# EAGLE design hwlcd (EAGLE 9.3.1)
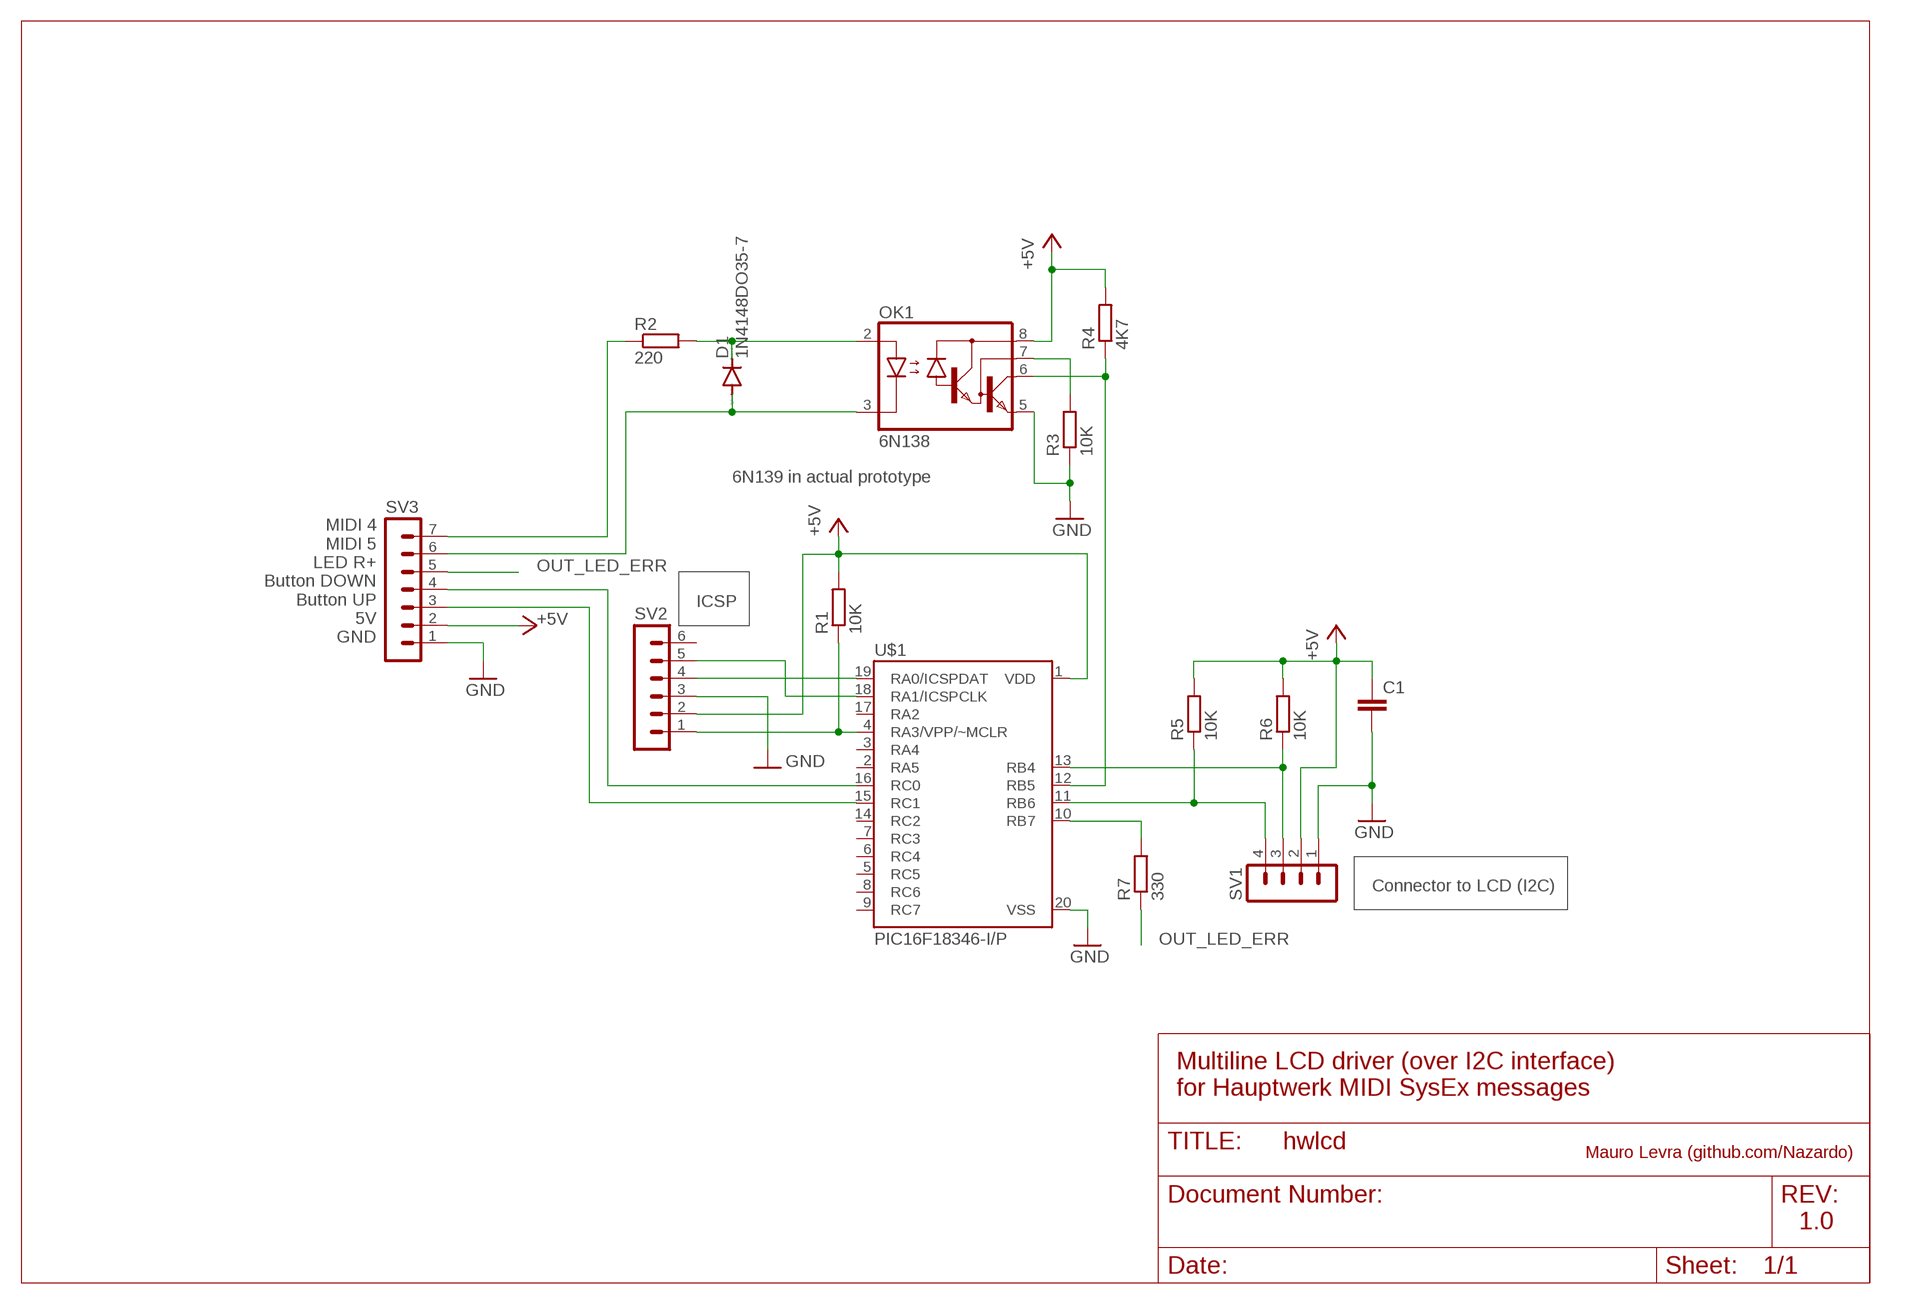
[diagram p0: schematic, sheet 1]

## Parts
C1  C-EU050-025X075  [C050-025X075]
D1  1N4148DO35-7  [DO35-7]
OK1  6N138  [DIL08]
R1  10K  R-EU_0204/7  [0204/7]
R2  220  R-EU_0204/7  [0204/7]
R3  10K  R-EU_0204/5  [0204/5]
R4  4K7  R-EU_0204/7  [0204/7]
R5  10K  R-EU_0207/2V  [0207/2V]
R6  10K  R-EU_0207/2V  [0207/2V]
R7  330  R-EU_0204/2V  [0204V]
SV1  MA04-1  [MA04-1]
SV2  MA06-1  [MA06-1]
SV3  MA07-1  [MA07-1]
U$1  PIC16F18346-I/P  [DIL20]

## Nets
+5V: C1.1 OK1.8(VCC) R1.2 R4.2 R5.2 R6.2 SV1.2 SV2.2 SV3.2 U$1.1(VDD)
GND: C1.2 OK1.5(GND) R3.1 SV1.1 SV2.3 SV3.1 U$1.20(VSS)
N$1: SV3.3 U$1.15(RC1)
N$2: SV3.4 U$1.16(RC0)
N$3: SV2.5 U$1.18(RA1/ICSPCLK)
N$4: R1.1 SV2.1 U$1.4(RA3/VPP/~MCLR)
N$5: SV2.4 U$1.19(RA0/ICSPDAT)
N$6: D1.C OK1.2(A) R2.2
N$7: D1.A OK1.3(C) SV3.6
N$8: R2.1 SV3.7
N$9: R7.2 U$1.10(RB7)
N$10: R6.1 SV1.3 U$1.13(RB4)
N$11: OK1.6(VO) R4.1 U$1.12(RB5)
N$12: R5.1 SV1.4 U$1.11(RB6)
N$13: OK1.7(VB) R3.2
OUT_LED_ERR: R7.1 SV3.5
Unconnected: SV2.6 U$1.2(RA5) U$1.3(RA4) U$1.5(RC5) U$1.6(RC4) U$1.7(RC3) U$1.8(RC6) U$1.9(RC7) U$1.14(RC2) U$1.17(RA2)

## Notes on the sheet
- 6N139 in actual prototype
- ICSP
- MIDI 4
  MIDI 5
  LED R+
  Button DOWN
  Button UP
  5V
  GND
- Connector to LCD (I2C)
- Multiline LCD driver (over I2C interface)
  for Hauptwerk MIDI SysEx messages
- Mauro Levra (github.com/Nazardo)
- 1.0

## Library data of the parts
C1 = rcl:C-EU: CAPACITOR, European symbol; SPICEPREFIX: C
D1 = diode:1N4148: DIODE high speed (Philips)
OK1 = optocoupler:6N138: MOTOROLA OPTO COUPLER; MF: VISHAY/TELEFUNKEN; MPN: 6N138; OC_FARNELL: 9860150; OC_NEWARK: 35K5294
R1-R7 = rcl:R-EU_: RESISTOR, European symbol; SPICEPREFIX: R
SV1 = con-lstb:MA04-1: PIN HEADER; OC_FARNELL: unknown; OC_NEWARK: unknown
SV2 = con-lstb:MA06-1: PIN HEADER; OC_FARNELL: unknown; OC_NEWARK: unknown
SV3 = con-lstb:MA07-1: PIN HEADER; OC_FARNELL: unknown; OC_NEWARK: unknown
U$1 = mylibrary:PIC16F18346-I/P: PIC16(L)F18346 microcontrollers feature Analog, Core Independent Peripherals and CommunicationPeripherals, combined with eXtreme Low Power (XLP) for a wide range of general purpose and low-power applications. The Peripheral Pin Select (PPS) functionality enables pin mapping when using the digital peripherals (CLC, CWG, CCP,PWM and communications) to add flexibility to the application design.

## Net classes
0 default: width 0.762 mm

## Board
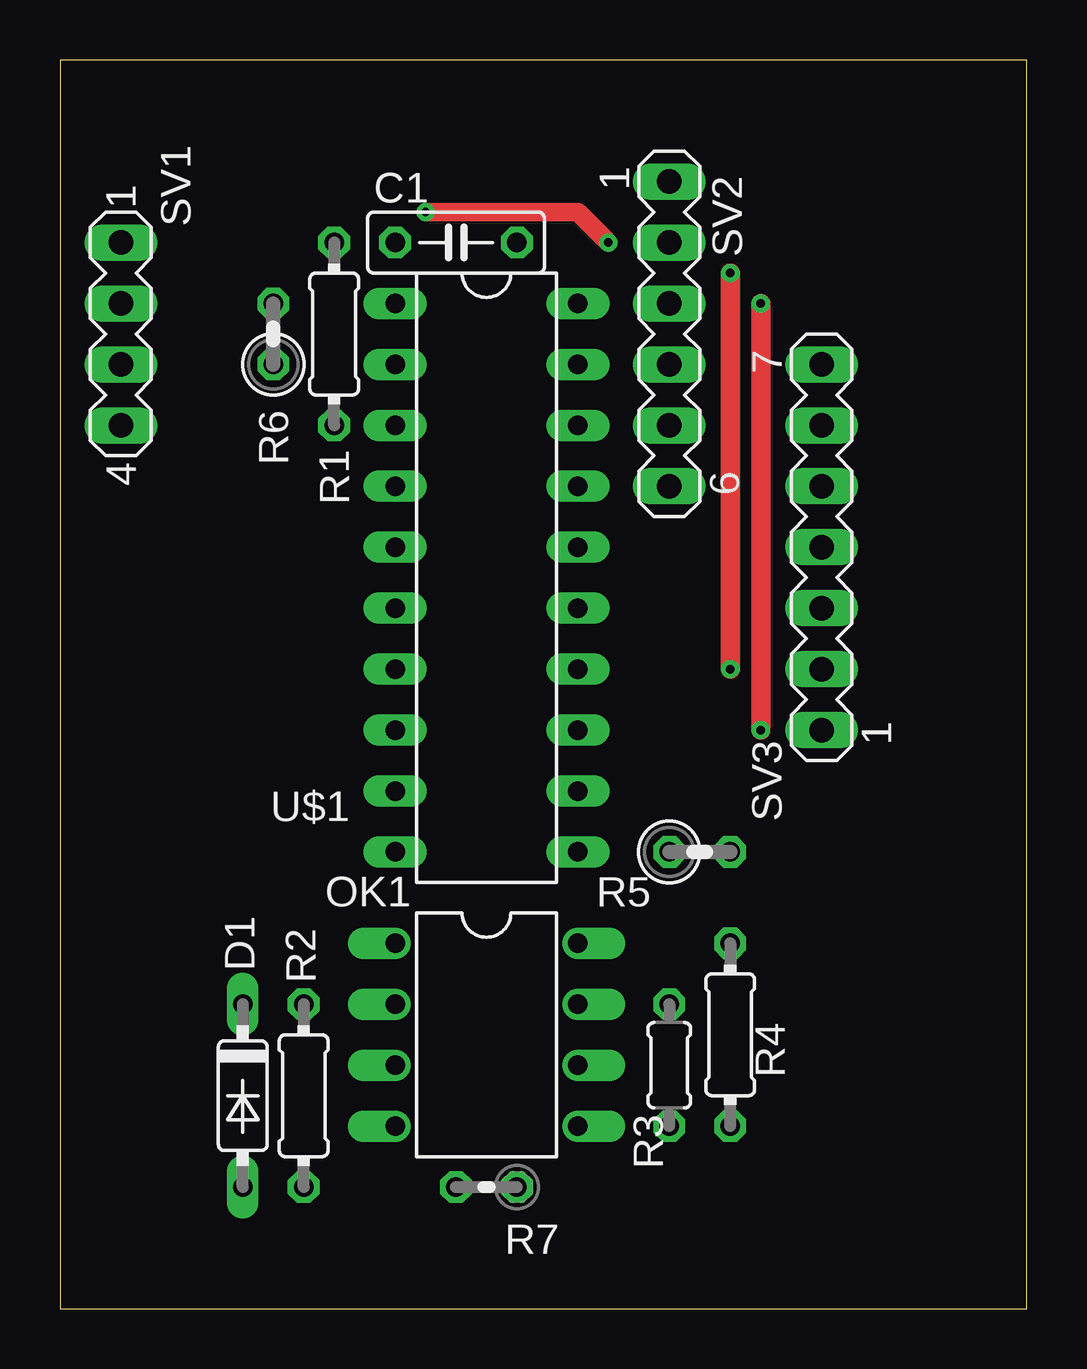
[diagram p1: board, top side]
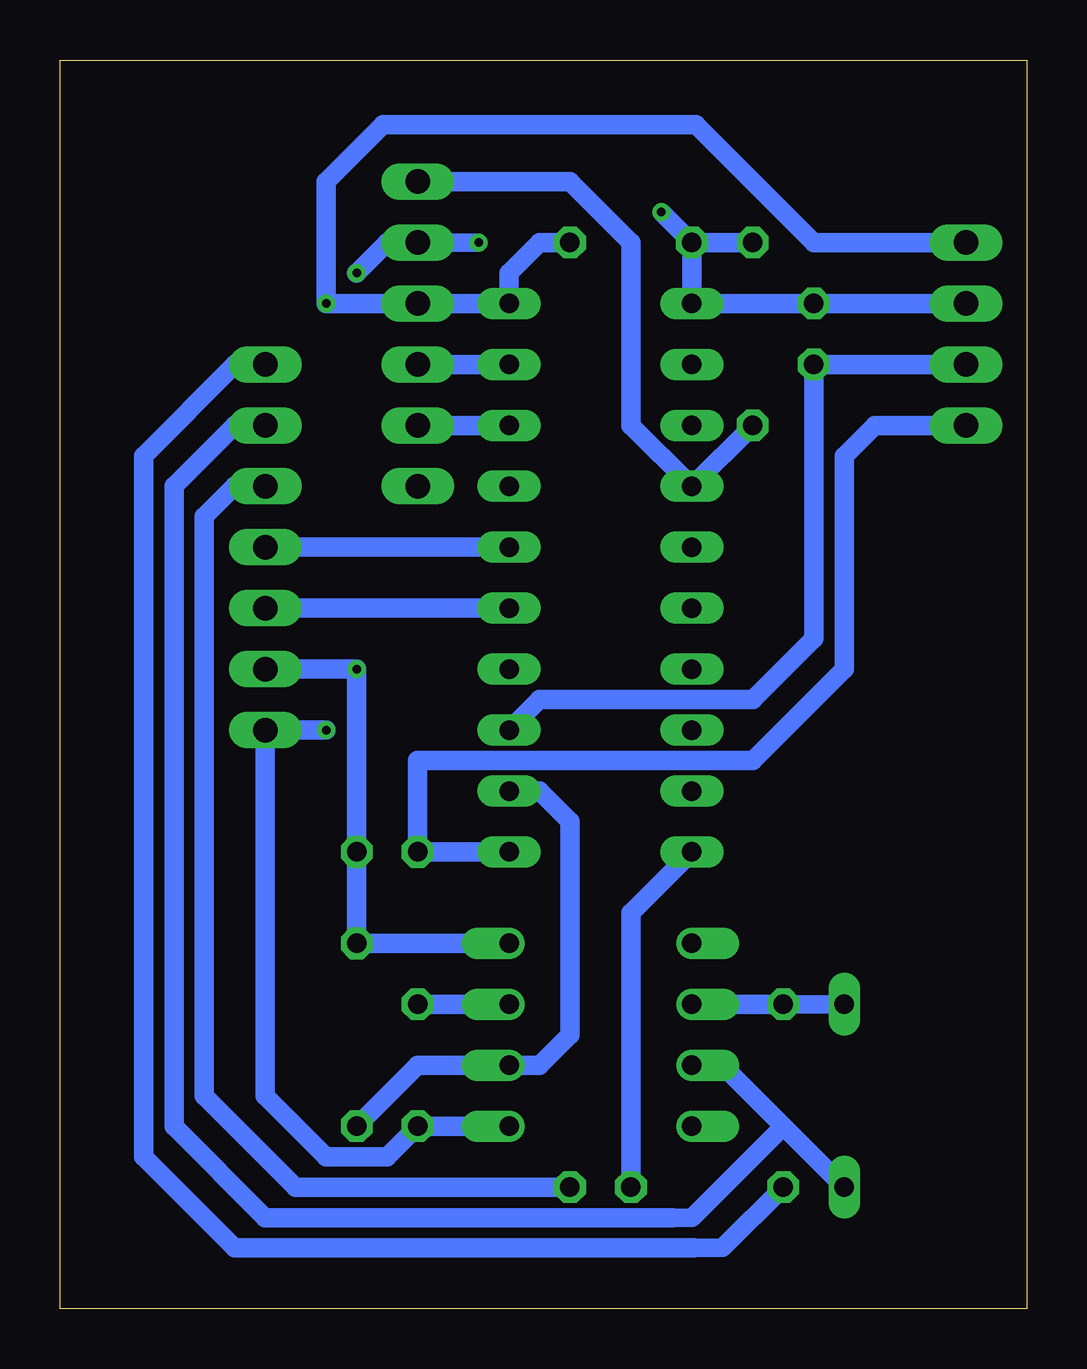
[diagram p2: board, bottom side, seen from below]

Size 40.31 x 52.06 mm. Coordinates in mm from the lower left corner, seen from the top.
Outline: 0,0 40.31,0 40.31,52.06 0,52.06 0,0
Copper layers (1*16): Top 0.035mm / dielectric 1.5mm / Bottom 0.035mm
Design rules "default": minimum track width 6mil, minimum drill 0.35mm, track to track 6mil, track to pad 6mil, pad to pad 6mil, via to via 6mil, smd to smd 6mil, copper to edge 40mil, drill to drill 6mil, minimum pad ring 10mil, minimum via ring 8mil, stop-mask expansion 4mil, vias tented up to drill 0mil, thermal gap 10mil

### Footprints (pad centres in the part's own frame; a part is rotated, then mirrored left to right if it is on the bottom)
C050-025X075 = drill 0.813 octagon: 1 -2.54,0; 2 2.54,0
DO35-7 = drill 0.813 long: A 3.81,0; C -3.81,0
DIL08 = drill 0.813 offset: 1 -3.81,-3.81; 2 -1.27,-3.81; 3 1.27,-3.81; 4 3.81,-3.81; 5 3.81,3.81; 6 1.27,3.81; 7 -1.27,3.81; 8 -3.81,3.81
0204/7 = drill 0.813 octagon: 1 -3.81,0; 2 3.81,0
0204/5 = drill 0.813 octagon: 1 -2.54,0; 2 2.54,0
0207/2V = drill 0.813 octagon: 1 -1.27,0; 2 1.27,0
0204V = drill 0.813 octagon: 1 -1.27,0; 2 1.27,0
MA04-1 = drill 1.016 long: 1 -3.81,0; 2 -1.27,0; 3 1.27,0; 4 3.81,0
MA06-1 = drill 1.016 long: 1 -6.35,0; 2 -3.81,0; 3 -1.27,0; 4 1.27,0; 5 3.81,0; 6 6.35,0
MA07-1 = drill 1.016 long: 1 -7.62,0; 2 -5.08,0; 3 -2.54,0; 4 0,0; 5 2.54,0; 6 5.08,0; 7 7.62,0
DIL20 = drill 0.813 long: 1 -11.43,-3.81; 2 -8.89,-3.81; 3 -6.35,-3.81; 4 -3.81,-3.81; 5 -1.27,-3.81; 6 1.27,-3.81; 7 3.81,-3.81; 8 6.35,-3.81; 9 8.89,-3.81; 10 11.43,-3.81; 11 11.43,3.81; 12 8.89,3.81; 13 6.35,3.81; 14 3.81,3.81; 15 1.27,3.81; 16 -1.27,3.81; 17 -3.81,3.81; 18 -6.35,3.81; 19 -8.89,3.81; 20 -11.43,3.81

### Placement (x,y rotation side)
C1  16.51,44.45 0 top
D1  7.62,8.89 270 top
OK1  17.78,11.43 270 top
R1  11.43,40.64 90 top
R2  10.16,8.89 90 top
R3  25.4,10.16 90 top
R4  27.94,11.43 90 top
R5  26.67,19.05 0 top
R6  8.89,40.64 90 top
R7  17.78,5.08 180 top
SV1  2.54,40.64 270 top
SV2  25.4,40.64 270 top
SV3  31.75,31.75 90 top
U$1  17.78,30.48 270 top

### Tracks (layer width: path | path; a pad name or v marks a point on that pad's centre or on a via)
+5V  (via drill 0.35)
  Top 0.762: v22.86,44.45 21.59,45.72 v15.24,45.72
  Top 0.813: v27.94,43.18 v27.94,26.67
  Bottom 0.762: SV2.2 v22.86,44.45 | v15.24,45.72 C1.1
  Bottom 0.813: SV1.2 R6.2 U$1.1 C1.1 R1.2 | OK1.8 R4.2 R5.2 v27.94,26.67 SV3.2 | SV2.2 26.67,44.45 v27.94,43.18
GND  (via drill 0.35)
  Top 0.813: v29.21,41.91 v29.21,24.13
  Bottom 0.813: C1.2 20.32,44.45 21.59,43.18 U$1.20 SV2.3 v29.21,41.91 29.21,46.99 26.83,49.37 13.81,49.37 8.89,44.45 SV1.1 | OK1.5 R3.1 26.67,6.35 29.21,6.35 31.75,8.89 SV3.1 v29.21,24.13
N$1
  Bottom 0.813: U$1.15 SV3.3
N$2
  Bottom 0.813: U$1.16 SV3.4
N$3
  Bottom 0.813: U$1.18 SV2.5
N$4
  Bottom 0.813: R1.1 U$1.4 16.51,36.83 16.51,44.45 19.05,46.99 SV2.1
N$5
  Bottom 0.813: U$1.19 SV2.4
N$6
  Bottom 0.762: D1.C R2.2
  Bottom 0.813: R2.2 OK1.2
N$7
  Bottom 0.762: D1.A 10.16,7.62 | 10.16,7.62 12.7,10.16 OK1.3 | 15.24,3.81 13.97,3.81 10.16,7.62
  Bottom 0.813: SV3.6 33.02,36.83 35.56,34.29 35.56,7.62 31.75,3.81 15.24,3.81 14.77,3.81
N$8
  Bottom 0.762: R2.1 12.7,2.54 13.88,2.54
  Bottom 0.813: SV3.7 33.02,39.37 36.83,35.56 36.83,6.35 33.02,2.54 13.88,2.54
N$9
  Bottom 0.813: R7.2 16.51,16.51 U$1.10
N$10
  Bottom 0.813: SV1.3 R6.1 8.89,27.94 11.43,25.4 20.32,25.4 U$1.13
N$11
  Bottom 0.813: R4.1 25.4,10.16 OK1.6 20.32,10.16 19.05,11.43 19.05,20.32 20.32,21.59 U$1.12
N$12
  Bottom 0.813: U$1.11 R5.1 25.4,22.86 11.43,22.86 7.62,26.67 7.62,35.56 6.35,36.83 SV1.4
N$13
  Bottom 0.813: OK1.7 R3.2
OUT_LED_ERR
  Bottom 0.813: SV3.5 33.02,34.29 34.29,33.02 34.29,8.89 30.48,5.08 R7.1